# EAGLE design RFID (EAGLE 9.6.2)
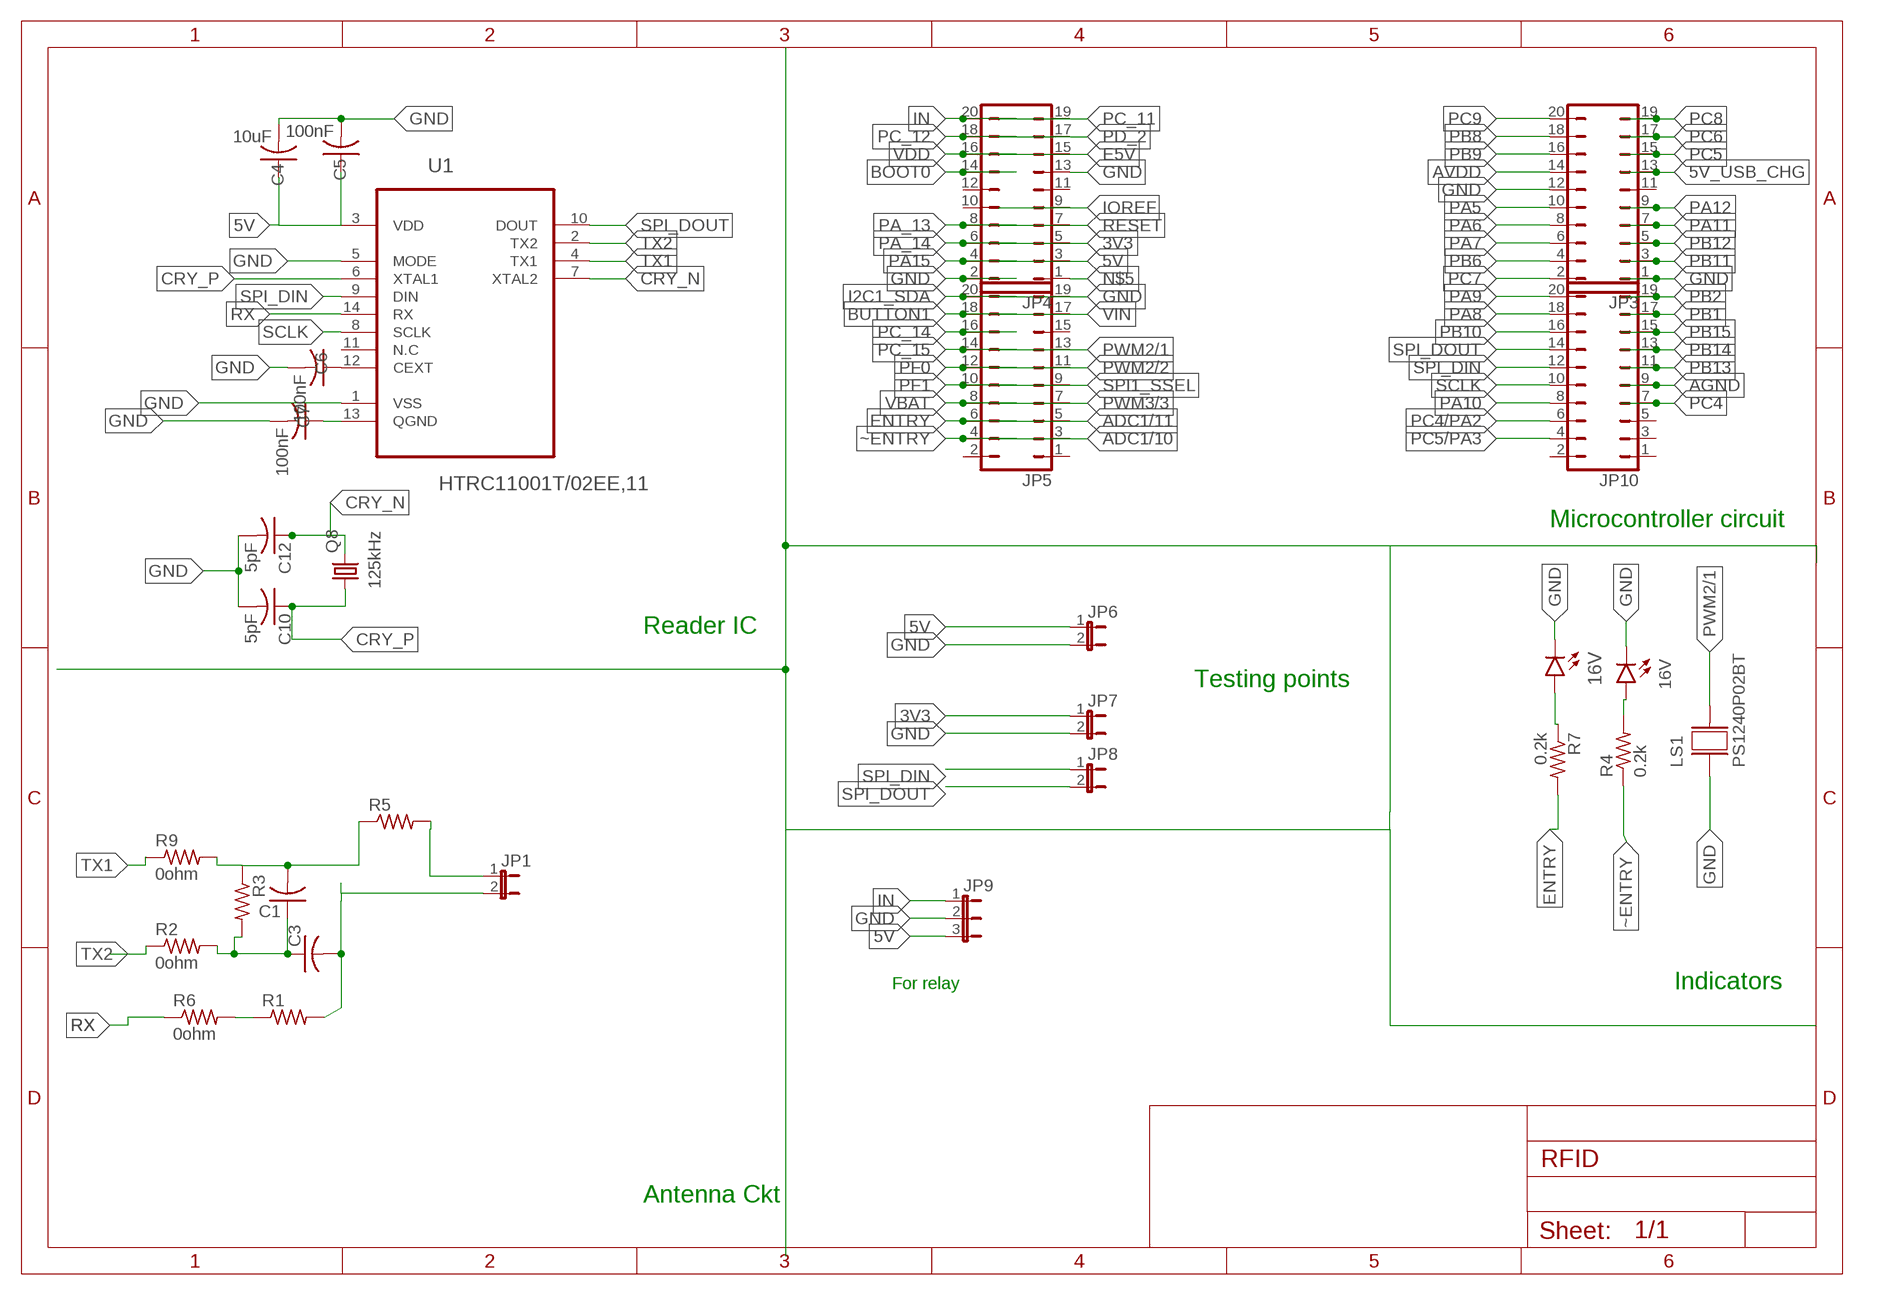
[diagram p0: schematic, sheet 1]

## Parts
C1  C-USC0805  [C0805]
C3  C-USC0805  [C0805]
C4  10uF  C-USC0805  [C0805]
C5  100nF  C-USC0805  [C0805]
C6  100nF  C-USC0805  [C0805]
C7  100nF  C-USC0805  [C0805]
C10  5pF  C-US025-024X044  [C025-024X044]
C12  5pF  C-US025-024X044  [C025-024X044]
GLED  16V  LED5MM  [LED5MM]
JP1  JP1E  [JP1]
JP3  JP10Q  [JP10Q]
JP4  JP10Q  [JP10Q]
JP5  JP10Q  [JP10Q]
JP6  JP1E  [JP1]
JP7  JP1E  [JP1]
JP8  JP1E  [JP1]
JP9  JP2E  [JP2]
JP10  JP10Q  [JP10Q]
LS1  PS1240P02BT  [XDCR_PS1240P02BT]
Q8  125kHz  CRYSTALHC49S  [HC49/S]
R1  R-US_R0603  [R0603]
R2  0ohm  R-US_R0603  [R0603]
R3  R-US_R0603  [R0603]
R4  0.2k  R-US_R0603  [R0603]
R5  R-US_R0603  [R0603]
R6  0ohm  R-US_R0603  [R0603]
R7  0.2k  R-US_R0603  [R0603]
R9  0ohm  R-US_R0603  [R0603]
RLED  16V  LED5MM  [LED5MM]
U1  HTRC11001T/02EE,11  [SOIC127P600X175-14N]

## Nets
3V3: JP4.5 JP7.1
5V: C4.1 C5.1 JP4.3 JP6.1 JP9.3 U1.3(VDD)
5V_USB_CHG: JP3.13
ADC1/10: JP5.3
ADC1/11: JP5.5
AGND: JP10.9
ANT1: JP1.1 R5.2
ANT2: C3.2 JP1.2 R1.2
ANT3: C1.1 C3.1 R2.2 R3.2
AVDD: JP3.14
BOOT0: JP4.14
BUTTON1: JP5.18
CRY_N [cry pairs]: C12.1 Q8.2 U1.7(XTAL2)
CRY_P [cry pairs]: C10.1 Q8.1 U1.6(XTAL1)
E5V: JP4.15
ENTRY: JP5.6 R7.2
GND: C4.2 C5.2 C6.2 C7.2 C10.2 C12.2 GLED.K(C) JP3.1 JP3.12 JP4.2 JP4.13 JP5.19 JP6.2 JP7.2 JP9.2 LS1.1 RLED.K(C) U1.1(VSS) U1.5(MODE)
I2C1_SDA: JP5.20
IN: JP4.20 JP9.1
IOREF: JP4.9
N$2: GLED.A R4.2
N$3: R7.1 RLED.A
N$4: R1.1 R6.2
N$5: JP4.1
N$6: R9.2
N$8: C6.1 U1.12(CEXT)
N$9: C7.1 U1.13(QGND)
PA5: JP3.10
PA6: JP3.8
PA7: JP3.6
PA8: JP10.18
PA9: JP10.20
PA10: JP10.8
PA11: JP3.7
PA12: JP3.9
PA15: JP4.4
PA_13: JP4.8
PA_14: JP4.6
PB1: JP10.17
PB2: JP10.19
PB6: JP3.4
PB8: JP3.18
PB9: JP3.16
PB10: JP10.16
PB11: JP3.3
PB12: JP3.5
PB13: JP10.11
PB14: JP10.13
PB15: JP10.15
PC4: JP10.7
PC4/PA2: JP10.6
PC5: JP3.15
PC5/PA3: JP10.4
PC6: JP3.17
PC7: JP3.2
PC8: JP3.19
PC9: JP3.20
PC_11: JP4.19
PC_12: JP4.18
PC_14: JP5.16
PC_15: JP5.14
PD_2: JP4.17
PF0: JP5.12
PF1: JP5.10
PWM2/1: JP5.13 LS1.2
PWM2/2: JP5.11
PWM3/3: JP5.7
RESET: JP4.7
RX: R6.1 U1.14(RX)
SCLK: JP10.10 U1.8(SCLK)
SPI1_SSEL: JP5.9
SPI_DIN: JP8.1 JP10.12 U1.9(DIN)
SPI_DOUT: JP8.2 JP10.14 U1.10(DOUT)
TX1: C1.2 R3.1 R5.1 R9.1 U1.4(TX1)
TX2: R2.1 U1.2(TX2)
VBAT: JP5.8
VDD: JP4.16
VIN: JP5.17
~ENTRY [POWER]: JP5.4 R4.1
Unconnected: JP3.11 JP4.10 JP4.11 JP4.12 JP5.1 JP5.2 JP5.15 JP10.1 JP10.2 JP10.3 JP10.5 U1.11(N.C)

## Notes on the sheet
- Microcontroller circuit
- Reader IC
- Testing points
- For relay | Indicators
- Antenna Ckt

## Library data of the parts
C1 C3-C7 = rcl:C-US: CAPACITOR, American symbol; SPICEPREFIX: C
C10 C12 = resistor:C-US: CAPACITOR, American symbol
GLED RLED = led:LED: LED OSRAM: - CHIPLED LG R971, LG N971, LY N971, LG Q971, LY Q971, LO R971, LY R971 LH N974, LH R974 LS Q976, LO Q976, LY Q976 LO Q996 - Hyper CHIPLED LW Q18S LB Q993, LB Q99A, LB R99A - SideLED LS A670, LO A670, LY A670, LG A670, LP A670 LB A673, LV A673, LT A673, LW A673 LH A674 LY A675 LS A676, LA A676, LO A676, LY A676, LW A676 LS A679, LY A679, LG A679 - Hyper Micro SIDELED® LS Y876, LA Y876, LO Y876, LY Y876 LT Y87S - SmartLED LW L88C, LW L88S LB L89C, LB L89S, LG L890 LS L89K, LO L89K, LY L89K LS L896, LA L896, LO L896, LY L896 - TOPLED LS T670, LO T670, LY T670, LG T670, LP T670 LSG T670, LSP T670, LSY T670, LOP T670, LYG T670 LG T671, LOG T671, LSG T671 LB T673, LV T673, LT T673, LW T673 LH T674 LS T676, LA T676, LO T676, LY T676, LB T676, LH T676, LSB T676, LW T676 LB T67C, LV T67C, LT T67C, LS T67K, LO T67K, LY T67K, LW E67C LS E67B, LA E67B, LO E67B, LY E67B, LB E67C, LV E67C, LT E67C LW T67C LS T679, LY T679, LG T679 LS T770, LO T770, LY T770, LG T770, LP T770 LB T773, LV T773, LT T773, LW T773 LH T774 LS E675, LA E675, LY E675, LS T675 LS T776, LA T776, LO T776, LY T776, LB T776 LHGB T686 LT T68C, LB T68C - Hyper Mini TOPLED® LB M676 - Mini TOPLED Santana® LG M470 LS M47K, LO M47K, LY M47K Source: http://www.osram.convergy.de LUXEON: - LUMILED® LXK2-PW12-R00, LXK2-PW12-S00, LXK2-PW14-U00, LXK2-PW14-V00 LXK2-PM12-R00, LXK2-PM12-S00, LXK2-PM14-U00 LXK2-PE12-Q00, LXK2-PE12-R00, LXK2-PE12-S00, LXK2-PE14-T00, LXK2-PE14-U00 LXK2-PB12-K00, LXK2-PB12-L00, LXK2-PB12-M00, LXK2-PB14-N00, LXK2-PB14-P00, LXK2-PB14-Q00 LXK2-PR12-L00, LXK2-PR12-M00, LXK2-PR14-Q00, LXK2-PR14-R00 LXK2-PD12-Q00, LXK2-PD12-R00, LXK2-PD12-S00 LXK2-PH12-R00, LXK2-PH12-S00 LXK2-PL12-P00, LXK2-PL12-Q00, LXK2-PL12-R00 Source: www.luxeon.com KINGBRIGHT: KA-3528ASYC Source: www.kingbright.com
JP1 JP6-JP8 = jumper:JP1E: JUMPER
JP3-JP5 JP10 = jumper:JP10Q: JUMPER
JP9 = jumper:JP2E: JUMPER
LS1 = PS1240P02BT:PS1240P02BT: Buzzers Transducer, Externally Driven Piezo 3V 4kHz 60dB @ 3V, 10cm Through Hole PC Pins Check availability <https://pricing.snapeda.com/parts/PS1240P02BT/TDK%20Corporation/view-part?ref=eda>; AVAILABILITY: In Stock; DESCRIPTION: Buzzers Transducer, Externally Driven Piezo 3 V - 4kHz 60dB @ 3V, 10cm Through Hole PC Pins; MF: TDK Corporation; MP: PS1240P02BT; PACKAGE: None; PRICE: None; PURCHASE-URL: https://pricing.snapeda.com/search/part/PS1240P02BT/?ref=eda
Q8 = crystal:CRYSTAL: CRYSTAL; OC_FARNELL: 1667008; OC_NEWARK: unknown
R1-R7 R9 = adafruit:R-US_: RESISTOR, American symbol
U1 = HTRC11001T_02EE_11:HTRC11001T/02EE,11: HITAG reader chip Check availability <https://pricing.snapeda.com/parts/HTRC11001T/02EE%2C11/NXP%20USA/view-part?ref=eda>; AVAILABILITY: In Stock; DESCRIPTION: RFID Reader IC 125kHz - - 4.5V ~ 5.5V 14-SOIC (0.154, 3.90mm Width); MF: NXP USA; MP: HTRC11001T/02EE,11; PACKAGE: SOIC-14 NXP Semiconductors; PRICE: None; PURCHASE-URL: https://pricing.snapeda.com/search/part/HTRC11001T/02EE,11/?ref=eda

## Net classes
0 default: width 0.203 mm
1 cry pairs: width 0.203 mm, clearance 0.205 mm to class 0, clearance 0.205 mm
2 POWER: width 0.203 mm, clearance 0.205 mm to class 0, clearance 0.205 mm to class 1, clearance 0.205 mm

## Board
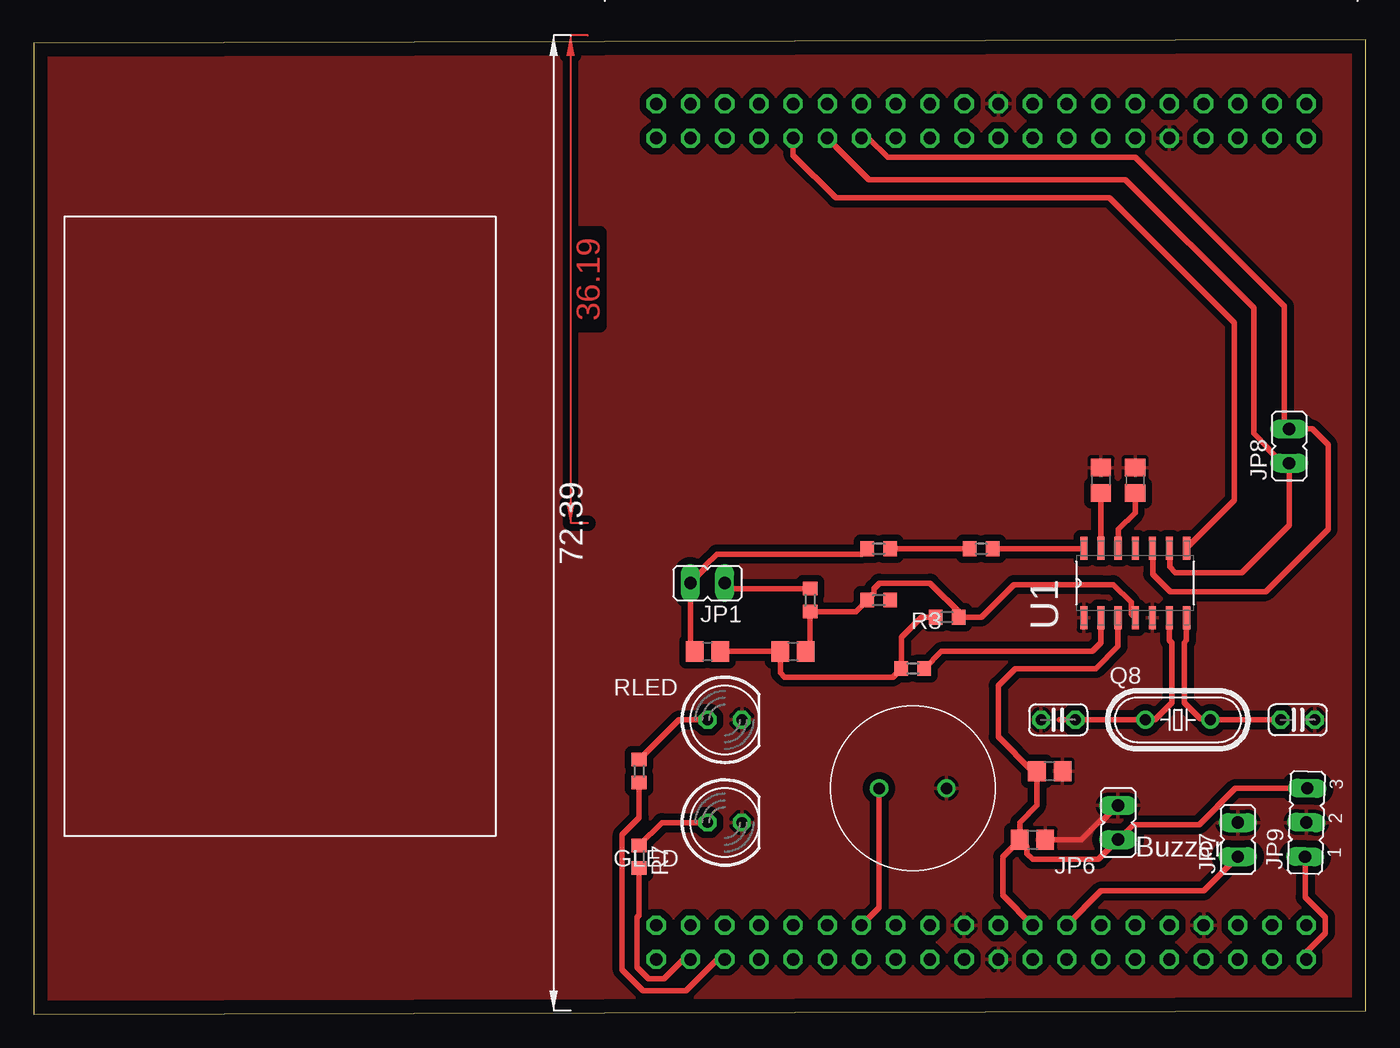
[diagram p1: board, top side]
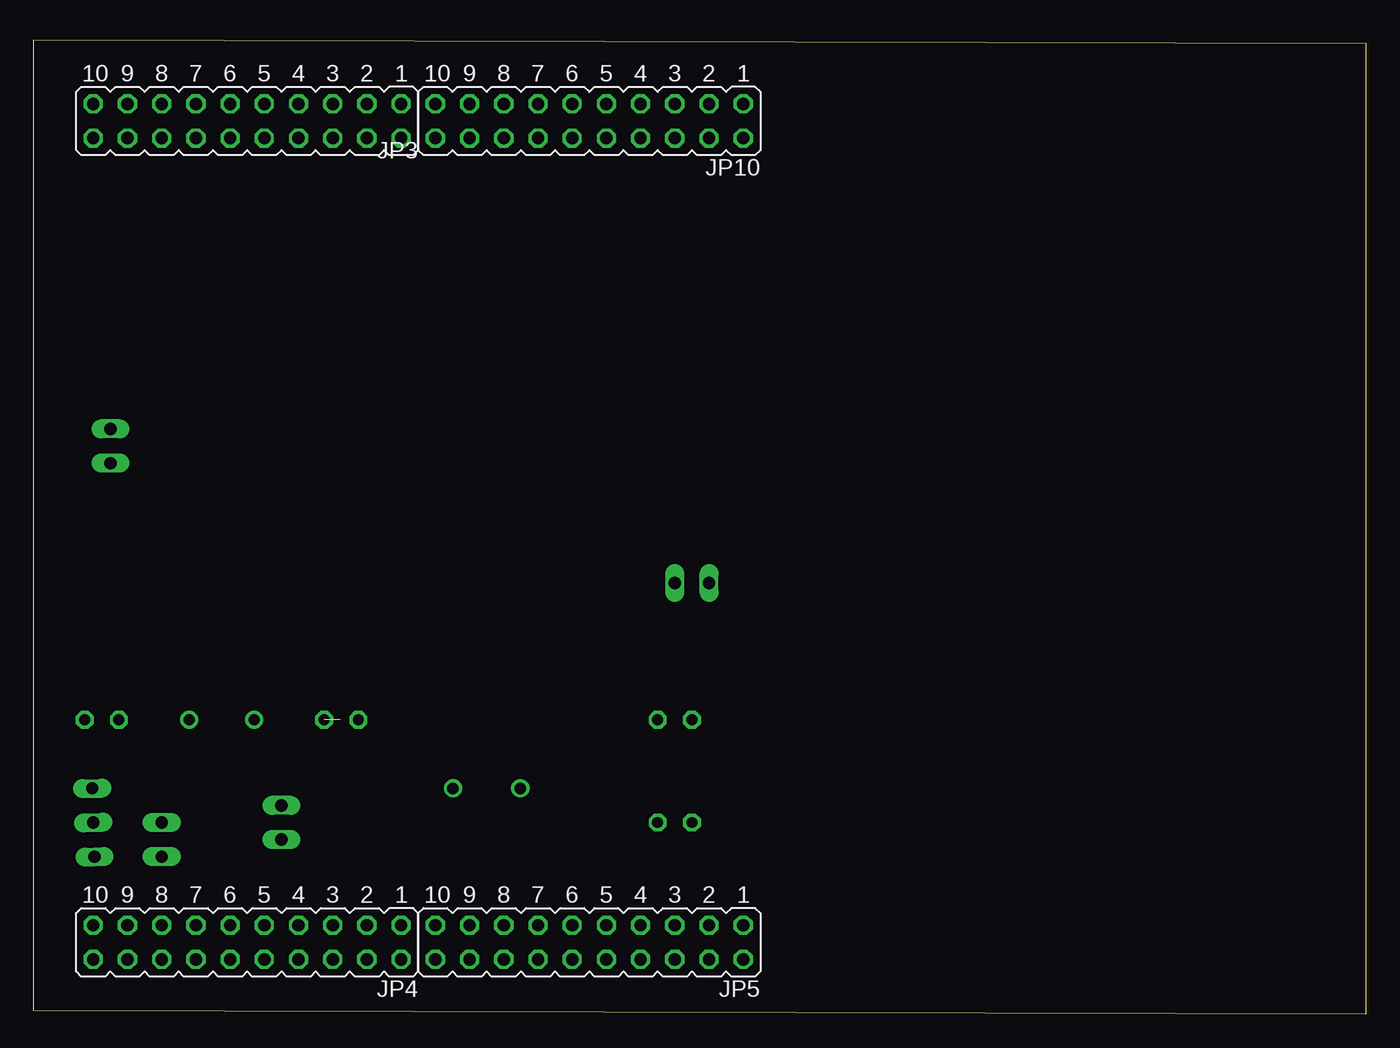
[diagram p2: board, bottom side, seen from below]

Size 98.91 x 72.31 mm. Coordinates in mm from the lower left corner, seen from the top.
Outline: 0,0 98.91,0.25 98.91,72.31 0,72.06 0,0
Copper layers (1*16): Top 0.035mm / dielectric 1.5mm / Bottom 0.035mm
Design rules "default *": minimum track width 16mil, minimum drill 0.35mm, track to track 20mil, track to pad 20mil, pad to pad 20mil, via to via 20mil, smd to smd 20mil, copper to edge 40mil, drill to drill 6mil, minimum pad ring 10mil, minimum via ring 8mil, stop-mask expansion 4mil, vias tented up to drill 0mil, thermal gap 10mil

### Footprints (pad centres in the part's own frame; a part is rotated, then mirrored left to right if it is on the bottom)
C0805 = smd 1.3 x 1.5: 1 -0.95,0; 2 0.95,0
C025-024X044 = drill 0.813 octagon: 1 -1.27,0; 2 1.27,0
LED5MM = drill 0.813 octagon: A -1.27,0; K 1.27,0
JP1 = drill 0.914 long: 1 0,-1.27; 2 0,1.27
JP10Q = drill 0.914 octagon: 1 -11.43,-1.27; 2 -11.43,1.27; 3 -8.89,-1.27; 4 -8.89,1.27; 5 -6.35,-1.27; 6 -6.35,1.27; 7 -3.81,-1.27; 8 -3.81,1.27; 9 -1.27,-1.27; 10 -1.27,1.27; 11 1.27,-1.27; 12 1.27,1.27; 13 3.81,-1.27; 14 3.81,1.27; 15 6.35,-1.27; 16 6.35,1.27; 17 8.89,-1.27; 18 8.89,1.27; 19 11.43,-1.27; 20 11.43,1.27
JP2 = drill 0.914 long: 1 -2.54,0; 2 0,0; 3 2.54,0
XDCR_PS1240P02BT = drill 0.85 pad 1.28: 1 -2.5,0; 2 2.5,0
HC49/S = drill 0.813: 1 -2.413,0; 2 2.413,0
R0603 = smd 1 x 1.1: 1 -0.85,0; 2 0.85,0
SOIC127P600X175-14N = smd 1.702 x 0.533: 1 -2.591,3.81; 2 -2.591,2.54; 3 -2.591,1.27; 4 -2.591,0; 5 -2.591,-1.27; 6 -2.591,-2.54; 7 -2.591,-3.81; 8 2.591,-3.81; 9 2.591,-2.54; 10 2.591,-1.27; 11 2.591,0; 12 2.591,1.27; 13 2.591,2.54; 14 2.591,3.81

### Placement (x,y rotation side)
C1  56.39,26.92 0 top
C3  50.04,26.92 180 top
C4  75.44,18.03 0 top
C5  74.17,12.95 0 top
C6  81.79,39.62 90 top
C7  79.25,39.62 90 top
C10  76.07,21.84 180 top
C12  93.85,21.84 0 top
GLED  51.31,14.22 0 top
JP1  50.04,32 90 top
JP3  83.06,66.29 180 bottom
JP4  83.06,5.33 180 bottom
JP5  57.66,5.33 180 bottom
JP6  80.52,14.22 0 top
JP7  89.41,12.95 0 top
JP8  93.22,42.16 0 top
JP9  94.49,14.22 88.2 top
JP10  57.66,66.29 180 bottom
LS1  65.28,16.76 180 top
Q8  84.96,21.84 0 top
R1  62.74,34.54 180 top
R2  65.28,25.65 180 top
R3  67.82,29.46 180 top
R4  44.96,11.68 90 top
R5  57.66,30.73 90 top
R6  70.36,34.54 180 top
R7  44.96,18.03 270 top
R9  62.74,30.73 0 top
RLED  51.31,21.84 0 top
U1  81.79,32 90 top

### Tracks (layer width: path | path; a pad name or v marks a point on that pad's centre or on a via)
3V3
  Top 0.406: JP4.5 79.25,9.14 86.87,9.14 JP7.1
5V
  Top 0.406: C5.1 73.22,14.22 74.49,15.49 C4.1 74.17,18.03 71.63,20.57 71.63,24.38 72.9,25.65 78.88,25.65 80.52,27.29 U1.3 | C5.1 71.95,11.68 71.95,8.82 JP4.3 | JP9.3 89.22,16.76 86.53,14.07 81.64,14.07 JP6.1 79.06,11.49 74.17,11.49 73.76,11.91 73.76,12.41 C5.1
ANT1
  Top 0.406: R5.2 51.73,31.58 JP1.1
ANT2
  Top 0.406: C3.2 48.77,26.98 JP1.2 49.89,33.12 49.89,33.3 50.72,34.14 61.48,34.14 R1.2
ANT3
  Top 0.406: C3.1 C1.1 55.44,25.33 55.76,25.01 63.78,25.01 R2.2 64.43,27.98 65.91,29.46 R3.2
CRY_N
  Top 0.406: U1.7 85.6,27.75 85.42,27.57 85.42,23.11 86.63,21.91 87.44,21.91 Q8.2 C12.1
CRY_P  (1 unrouted)
  Top 0.406: 82.42,21.84 Q8.1 | U1.6 84.33,27.75 84.51,27.57 84.51,23.11 83.24,21.84 Q8.1 | Q8.1 76.17,21.84
ENTRY
  Top 0.406: R7.2 44.96,14.59 43.7,13.33 43.7,3.29 45.26,1.73 48.44,1.73 50.78,4.06 JP5.6
GND
  Top 0.406: JP6.2 79.4,14.38 79.22,14.38 77.8,12.95 C5.2
  pour Top: 0,72.64 0,0.25 98.93,0.25 98.93,72.64
IN
  Top 0.406: JP9.1 94.41,8.7 95.91,7.19 95.91,6.02 94.49,4.59 JP4.20
N$2
  Top 0.406: R4.2 46.65,14.22 GLED.A
N$3
  Top 0.406: R7.1 47.92,21.84 RLED.A
N$4
  Top 0.406: R1.1 R6.2
N$8
  Top 0.406: U1.12 80.56,34.63 80.56,35.99 81.79,37.23 C6.1
N$9
  Top 0.406: U1.13 C7.1
PWM2/1
  Top 0.406: LS1.2 62.78,7.91 JP5.13
RX
  Top 0.406: R6.1 77.98,34.54 U1.14
SCLK
  Top 0.406: U1.8 89.15,38.15 89.15,51.31 79.88,60.58 59.56,60.58 56.39,63.75 JP10.10
SPI_DIN
  Top 0.406: U1.9 84.37,34.56 84.37,33.19 84.78,32.78 89.72,32.78 93.22,36.28 JP8.1 92.71,40.89 91.59,42.01 91.66,42.01 90.58,43.1 90.58,52.43 81.06,61.94 62.01,61.94 JP10.12
SPI_DOUT
  Top 0.406: U1.10 83.1,34.56 83.1,32.66 84.4,31.36 91.48,31.36 96.11,35.99 96.11,42.25 94.92,43.43 JP8.2 92.86,43.79 92.86,52.53 81.79,63.6 63.42,63.6 62,65.02 JP10.14
TX1
  Top 0.406: U1.4 81.5,29.71 81.5,30.56 80.16,31.89 79.25,31.89 72.78,31.89 70.36,29.46 R3.1 68.88,29.67 66.56,32 62.79,32 62.38,31.58 62.38,31.22 R9.1 61.04,29.88 58.29,29.88 R5.1 57.66,27.24 C1.2
TX2
  Top 0.406: R2.1 67.4,26.92 78.61,26.92 79.25,27.56 U1.2
~ENTRY
  Top 0.406: JP5.4 48.24,4.06 46.82,2.64 45.64,2.64 44.81,3.47 44.81,7.19 44.96,7.35 R4.1
(copper drawn outside any net)
  shapes: Top area x1

### Text on the board
tNames: Buzzer